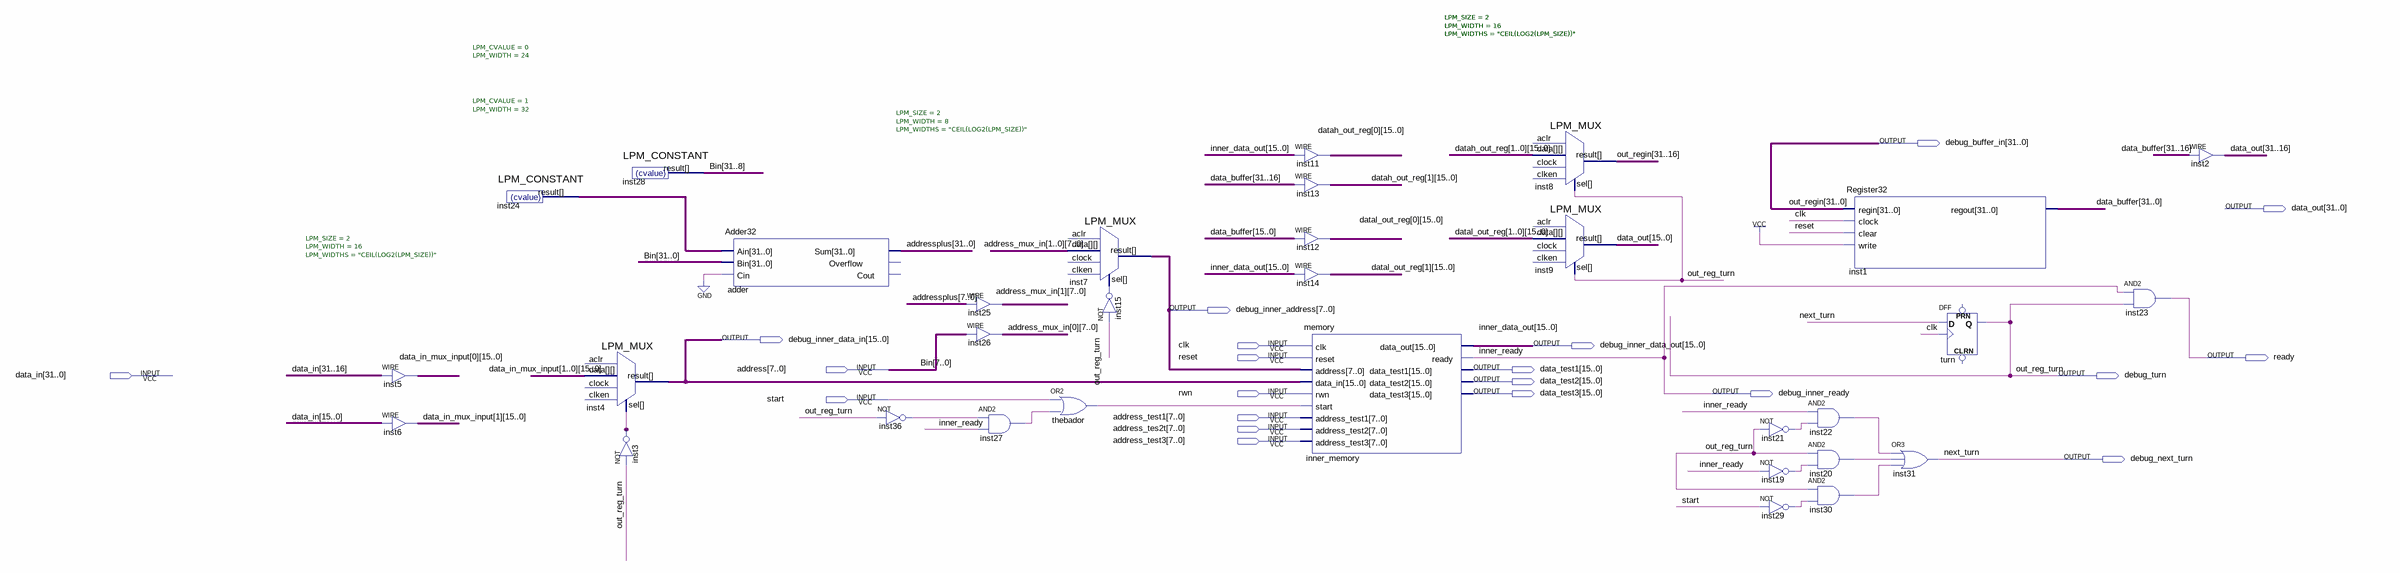
[diagram p0: schematic sheet]
// Quartus schematic wmemory.bdf as structural Verilog: 32 symbols, 21 pins
module wmemory (
  input  clk,
  input  reset,
  input  [7:0] address,
  input  [31:0] data_in,
  input  rwn,
  input  start,
  input  [7:0] address_test1,
  input  [7:0] address_tes2t,
  input  [7:0] address_test3,
  output [31:0] debug_buffer_in,
  output [31:0] data_out,
  output [7:0] debug_inner_address,
  output [15:0] debug_inner_data_in,
  output [15:0] debug_inner_data_out,
  output ready,
  output [15:0] data_test1,
  output debug_turn,
  output [15:0] data_test2,
  output [15:0] data_test3,
  output debug_inner_ready,
  output debug_next_turn
);

  wire inst3_out, inst15_out, inst19_out, inst20_out, inst21_out, inst22_out, inst27_out, inst29_out,
       inst30_out, inst36_out, thebador_out;
  wire [7:0] address_mux_in_0, address_mux_in_1;
  wire [15:0] data_in_mux_input_0, data_in_mux_input_1, datah_out_reg_0, datah_out_reg_1, datal_out_reg_0,
       datal_out_reg_1;
  wire [31:0] addressplus, data_buffer, inst24_result;
  wire [31:8] Bin;

  assign data_in_mux_input_0 = data_in[31:16];  // WIRE inst5
  assign data_in_mux_input_1 = data_in[15:0];  // WIRE inst6
  LPM_CONSTANT #(.LPM_CVALUE(1), .LPM_WIDTH(32)) inst24 (.result(inst24_result));
  LPM_CONSTANT #(.LPM_CVALUE(0), .LPM_WIDTH(24)) inst28 (.result(Bin));
  LPM_MUX #(.LPM_SIZE(2), .LPM_WIDTH(16), .LPM_WIDTHS("CEIL(LOG2(LPM_SIZE))")) inst4 (
    .data({data_in_mux_input_1, data_in_mux_input_0}), .sel(inst3_out), .result(debug_inner_data_in));  // open: clock, aclr, clken
  not inst3 (inst3_out, debug_turn);
  Adder32 adder (.Ain(inst24_result), .Bin({Bin, address}), .Cin(1'b0), .Sum(addressplus));  // open: Overflow, Cout
  not inst36 (inst36_out, debug_turn);
  assign address_mux_in_1 = addressplus[7:0];  // WIRE inst25
  assign address_mux_in_0 = address;  // WIRE inst26
  and inst27 (inst27_out, inst36_out, debug_inner_ready);
  or thebador (thebador_out, start, inst27_out);
  LPM_MUX #(.LPM_SIZE(2), .LPM_WIDTH(8), .LPM_WIDTHS("CEIL(LOG2(LPM_SIZE))")) inst7 (
    .data({address_mux_in_1, address_mux_in_0}), .sel(inst15_out), .result(debug_inner_address));  // open: clock, aclr, clken
  not inst15 (inst15_out, debug_turn);
  assign datah_out_reg_0 = debug_inner_data_out;  // WIRE inst11
  assign datah_out_reg_1 = data_buffer[31:16];  // WIRE inst13
  assign datal_out_reg_0 = data_buffer[15:0];  // WIRE inst12
  assign datal_out_reg_1 = debug_inner_data_out;  // WIRE inst14
  memory inner_memory (
    .clk(clk), .reset(reset), .address(debug_inner_address), .data_in(debug_inner_data_in), .rwn(rwn),
    .start(thebador_out), .address_test1(address_test1), .address_test2(address_tes2t),
    .address_test3(address_test3), .data_out(debug_inner_data_out), .ready(debug_inner_ready),
    .data_test1(data_test1), .data_test2(data_test2), .data_test3(data_test3));
  LPM_MUX #(.LPM_SIZE(2), .LPM_WIDTH(16), .LPM_WIDTHS("CEIL(LOG2(LPM_SIZE))")) inst8 (
    .data({datah_out_reg_1, datah_out_reg_0}), .sel(debug_turn), .result(debug_buffer_in[31:16]));  // open: clock, aclr, clken
  LPM_MUX #(.LPM_SIZE(2), .LPM_WIDTH(16), .LPM_WIDTHS("CEIL(LOG2(LPM_SIZE))")) inst9 (
    .data({datal_out_reg_1, datal_out_reg_0}), .sel(debug_turn), .result(data_out[15:0]));  // open: clock, aclr, clken
  not inst21 (inst21_out, debug_turn);
  not inst19 (inst19_out, debug_inner_ready);
  not inst29 (inst29_out, start);
  and inst22 (inst22_out, debug_inner_ready, inst21_out);
  and inst20 (inst20_out, debug_turn, inst19_out);
  and inst30 (inst30_out, debug_turn, inst29_out);
  Register32 inst1 (.regin(debug_buffer_in), .clock(clk), .clear(reset), .write(1'b1), .regout(data_buffer));
  or inst31 (debug_next_turn, inst22_out, inst20_out, inst30_out);
  DFF turn (.CLK(clk), .D(debug_next_turn), .Q(debug_turn));  // open: CLRN, PRN
  and inst23 (ready, debug_inner_ready, debug_turn);
  assign data_out[31:16] = data_buffer[31:16];  // WIRE inst2

  // Other names for the same wires on the sheet: Bin[7:0] = address; inner_data_out[15:0] = debug_inner_data_out;
  //   inner_ready = debug_inner_ready; next_turn = debug_next_turn; out_reg_turn = debug_turn;
  //   out_regin[31:0] = debug_buffer_in
endmodule
